# EAGLE design MC34063HV-02B-SMD (EAGLE 6.1)
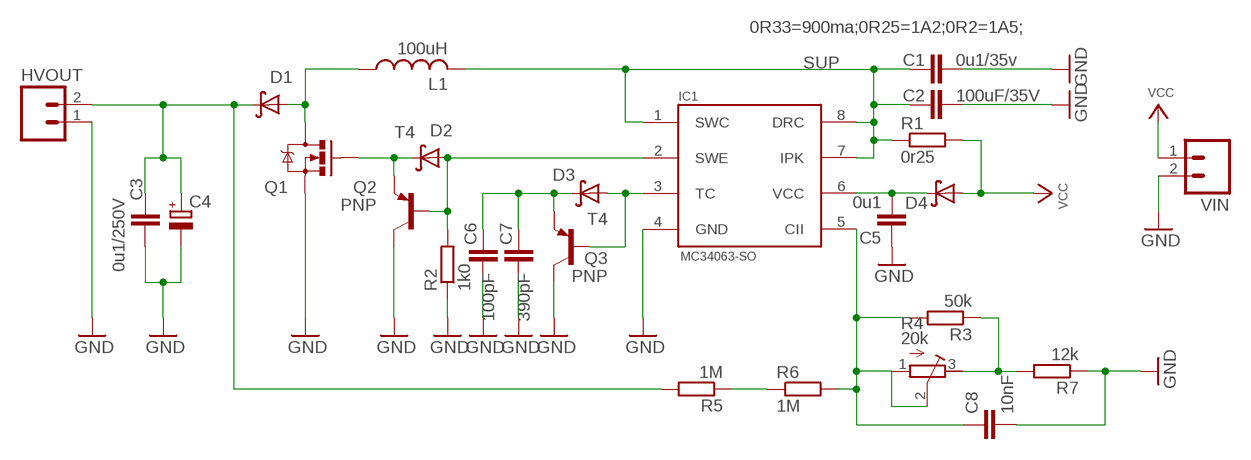
[diagram p0: schematic, sheet 1]

## Parts
C1  0u1/35v  C-EUC1206  [C1206]
C2  100uF/35V  C-EUC1206  [C1206]
C3  0u1/250V  C-EUC1206K  [C1206K]
C4  CPOL-EUE5-10.5  [E5-10,5]
C5  0u1  C-EUC0603  [C0603]
C6  100pF  C-EUC0603  [C0603]
C7  390pF  C-EUC0603  [C0603]
C8  10nF  C-EUC0603  [C0603]
D1  DIODE-SCHOTTKYSMA  [SMA-DIODE]
D2  T4  DIODE-SCHOTTKYSOD123  [SOD123]
D3  T4  DIODE-SCHOTTKYSOD323W  [SOD323-W]
D4  DIODE-SCHOTTKYSMA  [SMA-DIODE]
HVOUT  M02PTH  [1X02]
IC1  MC34063-SO  [SO8]
L1  100uH  INDUCTANCE_US11X11PLUG  [INDUCTOR11X11]
Q1  MOSFET-NCHANNELTO220V-BH2  [TO220V-BIGHOLE-V2]
Q2  PNP  [SOT23-BEC]
Q3  PNP  [SOT23-BEC]
R1  0r25  RESISTOR_EUR1206  [R1206]
R2  1k0  RESISTOR_EUR0603  [R0603]
R3  50k  RESISTOR_EUR0603  [R0603]
R4  20k  R-TRIMM3296W  [RTRIM3296W]
R5  1M  RESISTOR_EUR1206  [R1206]
R6  1M  RESISTOR_EUR1206  [R1206]
R7  12k  RESISTOR_EUR0603  [R0603]
VIN  M02PTH  [1X02]

## Nets
GND: C1.2 C2.2 C3.2 C4.- C5.1 C6.1 C7.1 C8.2 HVOUT.1 IC1.4(GND) Q1.3(S) Q2.3(C) Q3.3(C) R2.1 R7.1 VIN.2
HVFB: C8.1 IC1.5(CII) R3.2 R4.1(A) R4.2(S) R6.2
N$1: C6.2 C7.2 D3.C Q3.2(E)
N$3: D2.A IC1.2(SWE) Q2.1(B) R2.2
N$4: D2.C Q1.1(G) Q2.2(E)
N$5: C5.2 D4.C IC1.6(VCC)
N$6: C3.1 C4.+ D1.C HVOUT.2 R5.2
N$7: D3.A IC1.3(TC) Q3.1(B)
N$11: R5.1 R6.1
N$12: R3.1 R4.3(E) R7.2
SUP: C1.1 C2.1 IC1.1(SWC) IC1.7(IPK) IC1.8(DRC) L1.P$2 R1.1
SW: D1.A L1.P$1 Q1.2(D)
VCC: D4.A R1.2 VIN.1

## Notes on the sheet
- 0R33=900ma;0R25=1A2;0R2=1A5;

## Library data of the parts
C1-C3 C5-C8 = trans:C-EU: CAPACITOR, European symbol
C4 = trans:CPOL-EU: POLARIZED CAPACITOR, European symbol
D1-D4 = trans:DIODE-SCHOTTKY
HVOUT VIN = SparkFun:M02: Header 2 Standard 2-pin 0.1" header. Use with straight break away headers (SKU : PRT-00116), right angle break away headers (PRT-00553), swiss pins (PRT-00743), machine pins (PRT-00117), and female headers (PRT-00115). Molex polarized connector foot print use with SKU : PRT-08233 with associated crimp pins and housings.
IC1 = mc34063:MC34063-SO: DC/DC converter MC34063 in SO08.
L1 = trans:INDUCTANCE_US
Q1 = my-mosfet:MOSFET-NCHANNEL: Common NMOSFET Parts MFG P/N Store ID Prod ID FDD8780 TRANS-09984 SI7820DN TRANS-11055 FDS6630A IC-08089 2N7002PW TRANS-11151 FQP30N06L COM-10213 TRANS-10060 BSS123LT1G TRANS-08345 BSS138 TRANS-00830 BS170 2N7000
Q2 Q3 = trans:PNP
R1-R3 R5-R7 = trans:RESISTOR_EU: Resistor
R4 = switch:R-TRIMM: Trimm resistor

## Board
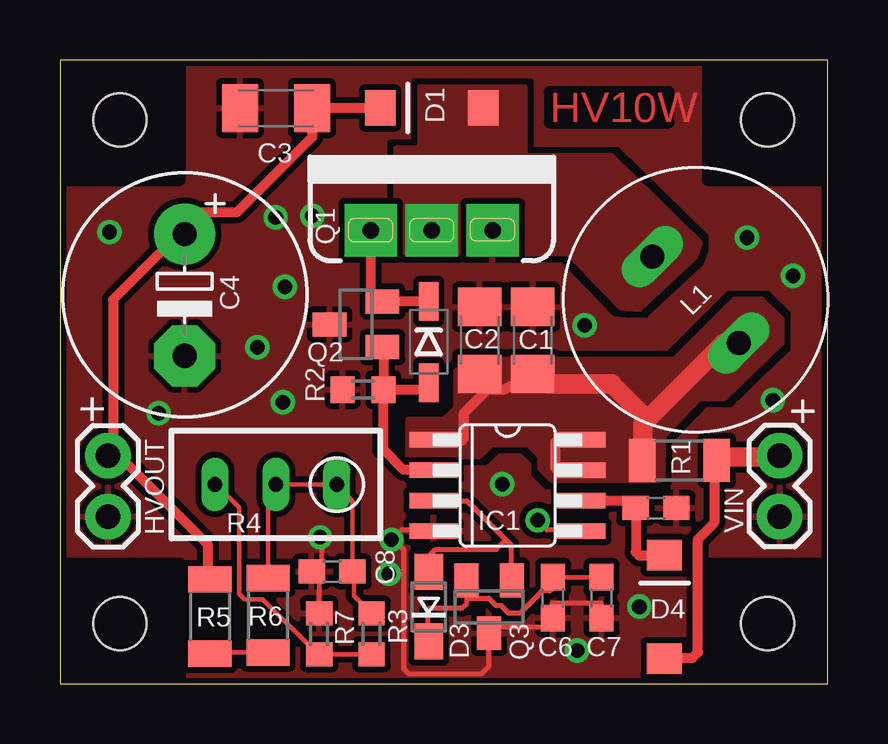
[diagram p1: board, top side]
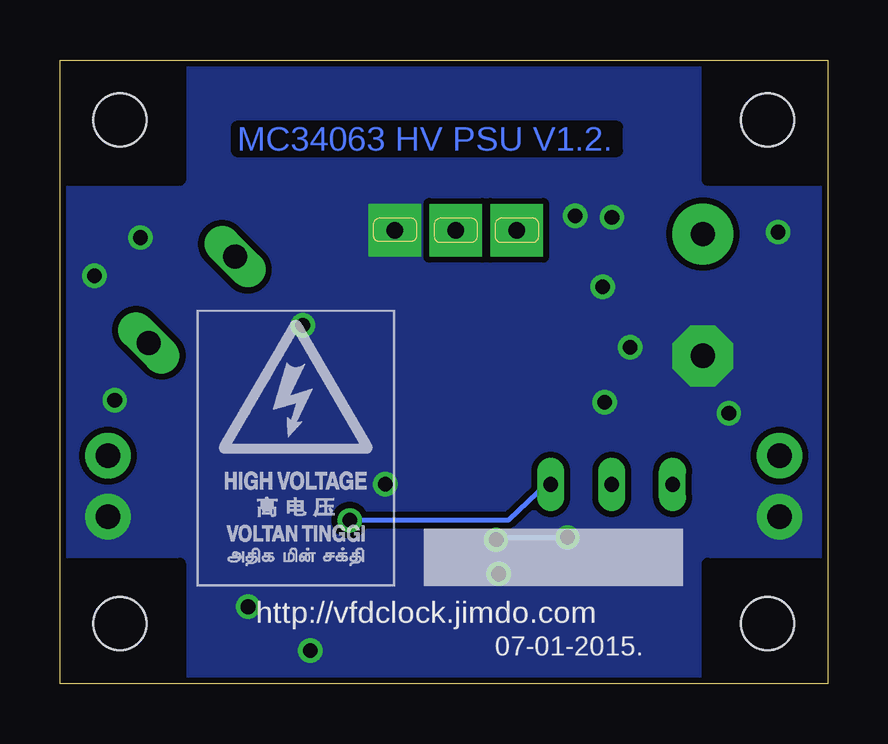
[diagram p2: board, bottom side, seen from below]

Size 32 x 26 mm. Coordinates in mm from the lower left corner, seen from the top.
Outline: 0,26 0,0 32,0 32,26 0,26
Copper layers (1*16): Top 0.035mm / dielectric 1.5mm / Bottom 0.035mm
Design rules: minimum track width 7mil, minimum drill 20mil, track to track 8mil, track to pad 8mil, pad to pad 8mil, via to via 8mil, smd to smd 8mil, copper to edge 10mil, drill to drill 8mil, minimum pad ring 10mil, minimum via ring 8mil, stop-mask expansion 4mil, vias tented up to drill 100mil, thermal gap 10mil
Holes 2.2 mm at 29.5,23.5 2.5,23.5 2.5,2.5 29.5,2.5
tRestrict: area 27,21 to 32,26; area 0,21 to 5,26; area 0,0 to 5,5; area 27,0 to 32,5
bRestrict: area 0,0 to 5,5; area 27,0 to 32,5; area 27,21 to 32,26; area 0,21 to 5,26

### Footprints (pad centres in the part's own frame; a part is rotated, then mirrored left to right if it is on the bottom)
C1206 = smd 1.6 x 1.8: 1 -1.4,0; 2 1.4,0
C1206K = smd 1.5 x 2: 1 -1.5,0; 2 1.5,0
E5-10,5 = drill 1.016 pad 2.54: + -2.54,0 | drill 1.016 pad 2.54 octagon: - 2.54,0
C0603 = smd 1.1 x 1: 1 -0.85,0; 2 0.85,0
SMA-DIODE = smd 1.27 x 1.47: A -2.15,0; C 2.15,0
SOD123 = smd 1.6 x 0.8: A 1.7,0; C -1.7,0
SOD323-W = smd 1.5 x 1.2: A 1.45,0; C -1.45,0
1X02 = drill 1.016 pad 1.88: 1 0,0; 2 2.54,0
SO8 = smd 0.66 x 2.032: 1 -1.905,-3.073; 2 -0.635,-3.073; 3 0.635,-3.073; 4 1.905,-3.073; 5 1.905,3.073; 6 0.635,3.073; 7 -0.635,3.073; 8 -1.905,3.073
INDUCTOR11X11 = drill 1 long: P$1 -2.54,0; P$2 2.54,0
TO220V-BIGHOLE-V2 = drill 0.7 pad 2.2 square: 1 -2.54,0; 2 0,0; 3 2.54,0
SOT23-BEC = smd 1 x 1.4: 1 -0.95,-1.1; 2 0.95,-1.1; 3 0,1.1
R1206 = smd 1.1 x 1.8: 1 -1.55,0; 2 1.55,0
R0603 = smd 1 x 1.1: 1 -0.85,0; 2 0.85,0
RTRIM3296W = drill 0.61 long: 1 0,-2.54; 2 0,0; 3 0,2.54

### Placement (x,y rotation side)
C1  19.71,14.31 90 top
C2  17.5,14.31 90 top
C3  9,24 180 top
C4  5.2,16.2 270 top
C5  24.85,7.32 180 top
C6  20.56,3.58 90 top
C7  22.58,3.58 90 top
C8  11.34,4.67 180 top
D1  15.5,24 180 top
D2  15.37,14.24 270 top
D3  15.37,3.2 90 top
D4  25.2,3.2 90 top
HVOUT  2,6.96 90 top
IC1  18.65,8.26 270 top
L1  26.5,16 315 top
Q1  15.5,18.9 0 top
Q2  12.34,14.98 90 top
Q3  17.89,3.2 180 top
R1  25.83,9.31 0 top
R2  12.64,12.26 0 top
R3  12.99,2.07 90 top
R4  9,8.3 90 top
R5  6.25,2.79 90 top
R6  8.67,2.85 90 top
R7  10.81,2.07 270 top
U$1  [HV03]  26.31,4.04 0 bottom
VIN  30,9.5 270 top

### Tracks (layer width: path | path; a pad name or v marks a point on that pad's centre or on a via)
GND  (via drill 0.6, 0.61)
  Top 0.178: C5.1 25.76,7.32 25.76,7.44 | 20.5,2.9 C6.1
  Top 0.203: IC1.4 15.54,6.4 14.22,6.4 v13.82,5.99 13.92,5.99 14.33,5.59 14.33,0.61 14.53,0.41 17.58,0.41 17.88,0.71 17.88,2.03 Q3.3 17.88,2.13 17.88,2.34 20.52,2.34 20.52,2.64 C6.1 20.52,2.74 20.52,3.35 22.55,3.35 22.55,2.74 C7.1 | 10.81,4.65 10.52,4.65 C8.2 | v10.85,6.1 10.9,6.1 10.9,4.65 10.81,4.65 | 10.81,4.65 R7.1
  Bottom 0.203: v10.85,6.1 13.69,6.1 v13.82,5.99
  other vias: 2.06,18.82 21.87,14.94 9.37,16.54 9.3,11.73 18.44,8.31 21.56,1.37 13.72,4.57 4.11,11.28 8.23,14.02 10.52,19.51 8.99,19.43 28.65,18.59 30.56,16.99 29.72,11.81 24.16,3.2
  pour Bottom (isolate 0.254, rank 6, no thermals): 32,26 32,0 0,0 0,26
  pour Top (isolate 0.254, rank 6): 32,26 32,0 0,0 0,26
HVFB  (via drill 0.6)
  Top 0.178: R6.2 8.69,4.42 8.69,8.01 8.91,8.23 R4.2 11.43,8.31 R4.1 11.58,8.23 12.19,7.62 12.19,4.72 C8.1 12.27,4.65 12.27,3.66 12.95,2.97 R3.2
  Top 0.203: v19.91,6.81 20.32,6.4 21.64,6.4 IC1.5
  Bottom 0.203: v19.91,6.81 13.31,6.81 11.68,8.33 R4.1
N$1
  Top 0.178: C6.2 20.57,4.42 22.55,4.42 C7.2
  Top 0.203: 16.97,3.56 16.97,3.35 16.76,3.15 15.44,3.15 15.34,3.05 15.34,1.73 D3.C | 16.97,3.56 16.97,4.27 Q3.2 | 16.97,3.56 17.88,3.56 18.19,3.25 18.39,3.25 18.69,2.95 19.2,2.95 20.12,3.86 20.42,3.86 20.52,3.96 20.52,4.37 C6.2
N$3
  Top 0.178: 15.01,8.91 15.54,8.91 IC1.2
  Top 0.406: R2.2 13.49,13.95 13.56,14.02 13.49,14.1 Q2.1 | R2.2 15.45,12.26 D2.A | R2.2 13.49,9.75 14.33,8.91 14.94,8.91 IC1.2
N$4
  Top 0.406: Q1.1 12.95,15.93 13.41,15.93 Q2.2 13.64,15.93 15.39,15.93 D2.C
N$5
  Top 0.178: 23.55,7.62 23.77,7.39 C5.2 | 21.79,7.62 IC1.6
  Top 0.406: 23.55,7.62 21.79,7.62 | D4.C 25.15,5.33 24.16,5.33 24,5.49 24,7.24 C5.2
N$6
  Top 0.406: D1.C C3.1 10.52,23.85 10.52,22.78 7.39,19.66 5.56,19.66 5.03,19.13 C4.+ 4.88,18.9 4.88,18.67 2.21,16 2.21,9.83 2.29,9.75 2.06,9.53 HVOUT.2 2.36,9.6 6.17,5.79 6.17,4.34 R5.2
N$7
  Top 0.203: 18.59,5.99 16.97,7.62 15.65,7.62 IC1.3 | 18.59,5.99 18.8,5.79 18.8,4.37 Q3.1 | D3.A 15.34,4.78 15.34,5.28 15.65,5.59 18.19,5.59 18.59,5.99
N$11
  Top 0.178: R5.1 6.33,1.29 8.61,1.29 R6.1
N$12
  Top 0.178: 10.74,1.29 R7.2 | R4.3 6.48,8.33 7.47,7.34 7.47,3.73 7.7,3.5 8.46,3.5 10.67,1.29 R7.2 | R3.1 12.95,1.22 10.9,1.22 R7.2
SUP
  Top 0.406: 24.31,10.17 24.31,10.52 | C1.1 18.52,12.27 17.83,12.27 16.84,11.28 16.84,10.21 16.76,10.13 15.62,10.13 IC1.1 | 21.57,10.13 20.73,10.13 20.65,10.06 20.65,8.99 20.73,8.91 21.72,8.91 IC1.7
  Top 0.813: 24.5,11.01 24.31,10.82 24.31,10.52 24.31,9.68 | 24.5,11.01 27.66,14.17 28.27,14.17 L1.P$2 | C1.1 19.7,12.57 20.12,12.57 20.34,12.5 23.01,12.5 24.5,11.01
  pour Top (rank 2, no thermals): 29.28,16 28.11,16 25.61,13.5 17,13.5 16.5,13 16.5,11.5 16,11 14.5,11 14.5,9.5 17.5,9.5 18,10 19.5,10 20,9.5 20,9 20.5,8.5 25,8.5 25.14,8.62 25.17,10.33 26.65,11.91 27.73,11.91 30.09,14.2 30.09,15.2
SW
  pour Top (isolate 0.254, no thermals): 15,24.85 15,22.3 14,22.3 14,18 21.23,17.92 23.39,15.69 24.16,15.61 26.47,17.76 26.7,18.38 23,22 19.38,22 19.38,24.85
VCC
  Top 0.406: R1.2 27.36,9.22 27.28,9.14 27.28,6.71 26.59,6.02 26.59,1.29 26.36,1.07 25.22,1.07 D4.A
  Top 0.813: R1.2 27.74,9.45 29.95,9.45 VIN.1

### Text on the board
Top: HV10W
Bottom: MC34063 HV PSU V1.2.
tPlace: + | +
bPlace: http://vfdclock.jimdo.com | 07-01-2015.
tStop: HV10W
bStop: MC34063 HV PSU V1.2.